# Altium schematic sheet PWR.SchDoc: PWR
size 420 x 297 mm; Organization: Altium Limited; Address1: L3, 12a Rodborough Rd; Address2: Frenchs Forest; Address3: NSW; Address4: Australia 2086; SheetNumber: 3; SheetTotal: 8
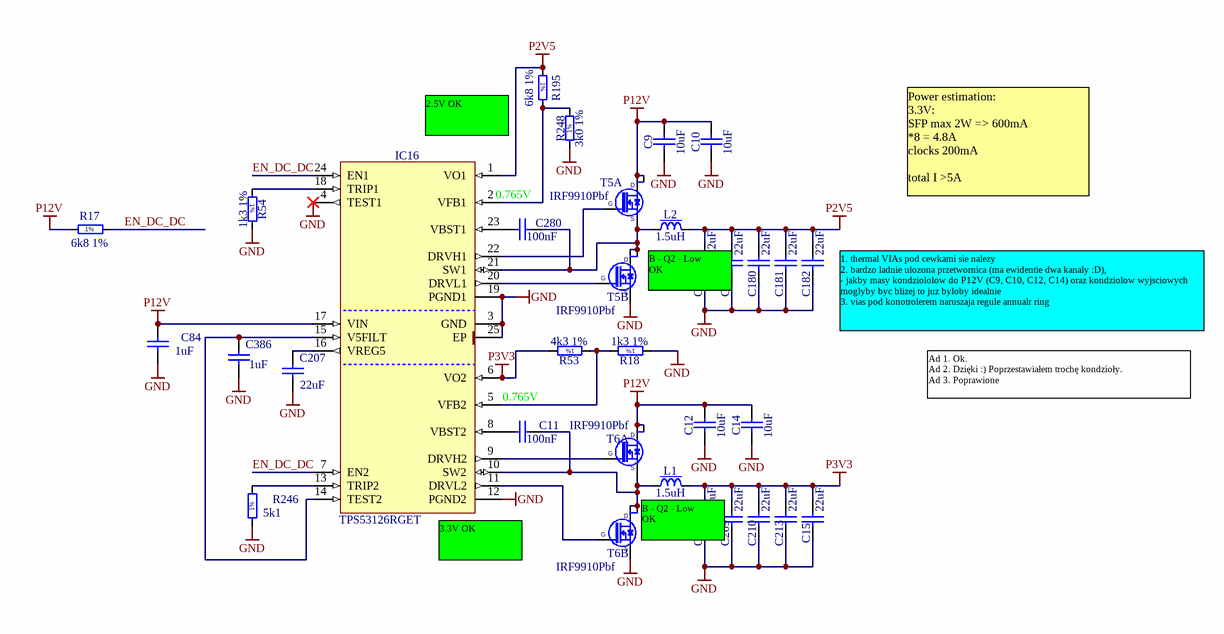
[diagram p0: PWR.SchDoc]

## Parts
C9  10uF  [CAPC3216X140N]
C10  10uF  [CAPC3216X140N]
C11  100nF  [CAPC1608X87N]
C12  10uF  [CAPC3216X140N]
C14  10uF  [CAPC3216X140N]
C15  22uF  [CAPC3216X180N]
C84  1uF  [CAPC1608X87N]
C176  22uF  [CAPC3216X180N]
C179  22uF  [CAPC3216X180N]
C180  22uF  [CAPC3216X180N]
C181  22uF  [CAPC3216X180N]
C182  22uF  [CAPC3216X180N]
C207  22uF  [CAPC3216X180N]
C208  22uF  [CAPC3216X180N]
C209  22uF  [CAPC3216X180N]
C210  22uF  [CAPC3216X180N]
C213  22uF  [CAPC3216X180N]
C280  100nF  [CAPC1608X87N]
C386  1uF  [CAPC1608X87N]
IC16  TPS53126RGET  [QFN50P400X400X100-25N-S255]
L1  1.5uH  [INDM6965X300N]
L2  1.5uH  [INDM6965X300N]
R17  6k8 1%  [0603R]
R18  1k3 1%  [0603R]
R53  4k3 1%  [0603R]
R54  1k3 1%  [0603R]
R195  6k8 1%  [0603R]
R246  5k1  [RESC1608X55N]
R248  3k0 1%  [0603R]
T5  IRF9910Pbf  [SOIC127P600X175-8N]  (parts A,B of 2)
T6  IRF9910Pbf  [SOIC127P600X175-8N]  (parts A,B of 2)

## Nets
GND: C9.1 C10.1 C12.1 C14.1 C15.1 C84.2 C176.1 C179.1 C180.1 C181.1 C182.1 C207.1 C208.1 C209.1 C210.1 C213.1 C386.1 IC16.3(GND) IC16.4(TEST1) IC16.12(PGND2) IC16.19(PGND1) IC16.25(EP) R18.1 R54.2 R246.1 R248.1 T5.1(S) T6.1(S)
P2V5: C176.2 C179.2 C180.2 C181.2 C182.2 IC16.1(VO1) L2.2 R195.1
P3V3: C15.2 C208.2 C209.2 C210.2 C213.2 IC16.6(VO2) L1.2 R53.2
P12V: C9.2 C10.2 C12.2 C14.2 C84.1 IC16.17(VIN) R17.1 T5.5(D) T5.6(D) T6.5(D) T6.6(D)
EN_DC_DC: IC16.7(EN2) IC16.24(EN1) R17.2
NetC11_1: C11.1 IC16.10(SW2) L1.1 T6.3(S) T6.7(D) T6.8(D)
NetC11_2: C11.2 IC16.8(VBST2)
NetC207_2: C207.2 IC16.16(VREG5)
NetC280_1: C280.1 IC16.21(SW1) L2.1 T5.3(S) T5.7(D) T5.8(D)
NetC280_2: C280.2 IC16.23(VBST1)
NetC386_2: C386.2 IC16.14(TEST2) IC16.15(V5FILT)
NetIC16_2: IC16.2(VFB1) R195.2 R248.2
NetIC16_5: IC16.5(VFB2) R18.2 R53.1
NetIC16_9: IC16.9(DRVH2) T6.4(G)
NetIC16_11: IC16.11(DRVL2) T6.2(G)
NetIC16_13: IC16.13(TRIP2) R246.2
NetIC16_18: IC16.18(TRIP1) R54.1
NetIC16_20: IC16.20(DRVL1) T5.2(G)
NetIC16_22: IC16.22(DRVH1) T5.4(G)

## Notes on the sheet
- 2.5V OK
- 0.765V
- Power estimation:
  3.3V:
  SFP max 2W => 600mA
  *8 = 4.8A
  clocks 200mA
  total I >5A
- B - Q2 - Low
  OK
- (near C182) 1. thermal VIAs pod cewkami sie nalezy
  2. bardzo ladnie ulozona przetwornica (ma ewidentie dwa kanaly :D),
  - jakby masy kondziololow do P12V (C9, C10, C12, C14) oraz kondziolow wyjsciowych moglyby byc blizej to juz byloby idealnie
  3. vias pod konotrolerem naruszaja regule annualr ring
- Ad 1. Ok.
  Ad 2. Dzięki :) Poprzestawiałem trochę kondzioły.
  Ad 3. Poprawione
- (near IC16) 3.3V OK
- Project/Equipment
- Document
- uTCA RTM 8 SFP+
- Designer
- Drawn by
- Check.by
- Copyright Creotech Instruments SA 2014.
  This documentation describes Open Hardware and is licensed under the CERN OHL v.1.1. You may redistribute and modify this documentation under the terms of the CERN OHL v.1.1. (http://ohwr.org/CERNOHL). This documentation is distributed WITHOUT ANY EXPRESS OR IMPLIED WARRANTY, INCLUDING OF MERCHANTABILITY, SATISFACTORY QUALITY AND FITNESS FOR A PARTICULAR PURPOSE. Please see the CERN OHL v.1.1 for applicable conditions.
- Creotech Instruments S.A.
- File
- Last Mod.
- Print Date
- Sheet
- Size
- A3
- of
- Rev
- (in symbol R0603_1K3_1%_0.1W_100PPM) 1%
- (in symbol R0603_3K_1%_0.1W_100PPM) 1%
- (in symbol R0603_4K3_1%_0.1W_100PPM) 1%
- (in symbol R0603_5K1_1%_0.1W_100PPM) 1%
- (in symbol R0603_6K8_1%_0.1W_100PPM) 1%

## Library data of the parts
C9 C10 C12 C14 = CC1206_10UF_16V_10%_X7R: Non-polarised capacitor; Part Description: SMD Multilayer Chip Ceramic Capacitor; Manufacturer: GENERIC; Manufacturer1 Part Number: C1206C106K4RAC; Voltage: 16V; TC: X7R; Tolerance: ±10%; Table: Capacitors SMD; Part Number: CC1206_10UF_16V_10%_X7R; Component Kind: Standard; Component Type: Standard; Pin Count: 2; Value: 10uF; Status: Preferred; Manufacturer Part Number: CC1206_10uF_16V_10%_X7R; Case: 1206; Mounted: Yes; Socket: No; SMD: Yes; Manufacturer1 Example: KEMET; Manufacturer1 ComponentHeight: 1.8mm; HelpURL: \\cern.ch\dfs\Applications\Altium\Datasheets\CC1206_X7R_KEMET.pdf; Author: CERN DEM JLC; CreateDate: 2009-04-28; LatestRevisionDate: 2009-04-28
C11 C280 = CC0603_100NF_50V_10%_X7R: Non-polarised capacitor; Part Description: SMD Multilayer Chip Ceramic Capacitor; Manufacturer: GENERIC; Manufacturer1 Part Number: 223858615649; Voltage: 50V; TC: X7R; Tolerance: ±10%; Table: Capacitors SMD; Part Number: CC0603_100NF_50V_10%_X7R; Component Kind: Standard; Component Type: Standard; Pin Count: 2; Value: 100nF; Status: Preferred; Manufacturer Part Number: CC0603_100NF_50V_10%_X7R; Case: 0603; Mounted: Yes; Socket: No; SMD: Yes; Manufacturer1 Example: PHYCOMP; Manufacturer1 ComponentHeight: 0.87mm; HelpURL: \\cern.ch\dfs\Applications\Altium\Datasheets\CC0603_X7R_PHYCOMP.pdf; Author: CERN DEM JLC; CreateDate: 2007-12-03; LatestRevisionDate: 2007-12-03
C15 C176 C179-C182 C207-C210 C213 = CC1206_22UF_10V_10%_X7R: Non-polarised capacitor; Part Description: SMD Multilayer Chip Ceramic Capacitor; Manufacturer: GENERIC; Manufacturer1 Part Number: GRM31CR71A226KE15L; Voltage: 10V; TC: X7R; Tolerance: ±10%; Table: Capacitors SMD; Part Number: CC1206_22UF_10V_10%_X7R; Component Kind: Standard; Component Type: Standard; Pin Count: 2; Value: 22uF; Status: Preferred; Manufacturer Part Number: CC1206_22UF_10V_10%_X7R; Case: 1206; Mounted: Yes; Socket: No; SMD: Yes; Manufacturer1 Example: MURATA; Manufacturer1 ComponentHeight: 1.8mm; HelpURL: \\cern.ch\dfs\Applications\Altium\Datasheets\CC1206_X7R_MURATA_GRM-HI-CAP.pdf; Author: CERN DEM JLC; CreateDate: 2010-06-08; LatestRevisionDate: 2010-06-08
C84 C386 = CC0603_1UF_16V_10%_X7R: Non-polarised capacitor; Part Description: SMD Multilayer Chip Ceramic Capacitor; Manufacturer: GENERIC; Manufacturer1 Part Number: 223824613663; Voltage: 16V; TC: X7R; Tolerance: ±10%; Table: Capacitors SMD; Part Number: CC0603_1UF_16V_10%_X7R; Component Kind: Standard; Component Type: Standard; Pin Count: 2; Value: 1uF; Status: Preferred; Manufacturer Part Number: CC0603_1uF_16V_10%_X7R; Case: 0603; Mounted: Yes; Socket: No; SMD: Yes; Manufacturer1 Example: PHYCOMP; Manufacturer1 ComponentHeight: 0.87mm; HelpURL: \\cern.ch\dfs\Applications\Altium\Datasheets\CC0805_X5R_PHYCOMP_HC.pdf; Author: CERN DEM JLC
  C84: CreateDate: 12/3/2007; LatestRevisionDate: 12/3/2007
  C386: CreateDate: 03/12/2007; LatestRevisionDate: 03/12/2007
IC16 = TPS53126RGET: Dual Synchronous Step-Down Controller For Low Voltage Power Rails; Manufacturer: TEXAS INSTRUMENTS; Table: Analog & Interface; Part Number: TPS53126RGET; Component Kind: Standard; Component Type: Standard; Device: TPS53126RGET; PackageDescription: QFN,0.50mm pitch,square;6 pin X 6 pin,4.15mm X 4.15mm X 1.00mm H body (w/thermal tab 2.55 X 2.55mm),  IPC Medium Density; Part Description: Dual Synchronous Step-Down Controller For Low Voltage Power Rails; Manufacturer Part Number: TPS53126RGET; Pin Count: 25; Case: QFN24; Mounted: Yes; Socket: No; SMD: Yes; ComponentHeight: 1.0mm; Author: CERN DEM JLC; HelpURL: \\cern.ch\dfs\Applications\Altium\Datasheets\TPS53126RGET.pdf; CreateDate: 2010-08-26; LatestRevisionDate: 2010-08-26
L1 L2 = IND2525_1.5UH_20%_VISHAY_IHLP-2525CZ: Inductor With Magnetic core; Part Description: Low Profile, High Current IHLP® Inductor; Manufacturer: VISHAY DALE; Manufacturer Part Number: IHLP2525CZER1R5M01; Power: 9A; Resistance: 0.014R; Tolerance: ±20%; Table: Inductors SMD; Part Number: IND2525_1.5UH_20%_VISHAY_IHLP-2525CZ; Component Kind: Standard; Component Type: Standard; Pin Count: 2; Value: 1.5uH; Status: None; Case: 2525; Mounted: Yes; Socket: No; SMD: Yes; ComponentHeight: 3mm; HelpURL: \\cern.ch\dfs\Applications\Altium\Datasheets\IND2525_VISHAY_IHLP-2525CZ.pdf; Author: CERN DEM JLC; CreateDate: 2012-10-24; LatestRevisionDate: 2012-10-24
R17 R195 = R0603_6K8_1%_0.1W_100PPM: Resistor - 1%; Part Description: General Purpose Thick Film Chip Resistor; Manufacturer: GENERIC; Manufacturer1 Part Number: NRC06F6801TRF; Power: 0.1W; TC: ±100ppm/°C; Table: Resistors SMD; Part Number: R0603_6K8_1%_0.1W_100PPM; Component Kind: Standard; Component Type: Standard; Footprint: RESC1608X55N; Pin Count: 2; Value: 6k8; Status: Preferred; Tolerance: ±1%; Manufacturer Part Number: R0603_6K8_1%_0.1W_100PPM; Case: 0603; Mounted: Yes; Socket: No; SMD: Yes; Manufacturer1 Example: NIC COMPONENT; Manufacturer1 ComponentHeight: 0.55mm; HelpURL: \\cern.ch\dfs\Applications\Altium\Datasheets\R0603_NIC_NRC.pdf; Author: CERN DEM JLC; CreateDate: 2007-12-03; LatestRevisionDate: 2008-03-13
R18 R54 = R0603_1K3_1%_0.1W_100PPM: Resistor - 1%; Part Description: General Purpose Thick Film Chip Resistor; Manufacturer: GENERIC; Manufacturer1 Part Number: NRC06F1301TRF; Power: 0.1W; TC: ±100ppm/°C; Table: Resistors SMD; Part Number: R0603_1K3_1%_0.1W_100PPM; Component Kind: Standard; Component Type: Standard; Footprint: RESC1608X55N; Pin Count: 2; Value: 1k3; Status: Preferred; Tolerance: ±1%; Manufacturer Part Number: R0603_1K3_1%_0.1W_100PPM; Case: 0603; Mounted: Yes; Socket: No; SMD: Yes; Manufacturer1 Example: NIC COMPONENT; Manufacturer1 ComponentHeight: 0.55mm; HelpURL: \\cern.ch\dfs\Applications\Altium\Datasheets\R0603_NIC_NRC.pdf; Author: CERN DEM JLC; CreateDate: 2007-12-03; LatestRevisionDate: 2008-03-13
R53 = R0603_4K3_1%_0.1W_100PPM: Resistor - 1%; Part Description: General Purpose Thick Film Chip Resistor; Manufacturer: GENERIC; Manufacturer1 Part Number: NRC06F4301TRF; Power: 0.1W; TC: ±100ppm/°C; Table: Resistors SMD; Part Number: R0603_4K3_1%_0.1W_100PPM; Component Kind: Standard; Component Type: Standard; Footprint: RESC1608X55N; Pin Count: 2; Value: 4k3; Status: Preferred; Tolerance: ±1%; Manufacturer Part Number: R0603_4K3_1%_0.1W_100PPM; Case: 0603; Mounted: Yes; Socket: No; SMD: Yes; Manufacturer1 Example: NIC COMPONENT; Manufacturer1 ComponentHeight: 0.55mm; HelpURL: \\cern.ch\dfs\Applications\Altium\Datasheets\R0603_NIC_NRC.pdf; Author: CERN DEM JLC; CreateDate: 2007-12-03; LatestRevisionDate: 2008-03-13
R246 = R0603_5K1_1%_0.1W_100PPM: Resistor - 1%; Part Description: General Purpose Thick Film Chip Resistor; Manufacturer: GENERIC; Manufacturer1 Part Number: NRC06F5101TRF; Power: 0.1W; TC: ±100ppm/°C; Table: Resistors SMD; Part Number: R0603_5K1_1%_0.1W_100PPM; Component Kind: Standard; Component Type: Standard; Pin Count: 2; Value: 5k1; Status: Preferred; Tolerance: ±1%; Manufacturer Part Number: R0603_5K1_1%_0.1W_100PPM; Case: 0603; Mounted: Yes; Socket: No; SMD: Yes; Manufacturer1 Example: NIC COMPONENT; Manufacturer1 ComponentHeight: 0.55mm; HelpURL: \\cern.ch\dfs\Applications\Altium\Datasheets\R0603_NIC_NRC.pdf; Author: CERN DEM JLC; CreateDate: 2007-12-03; LatestRevisionDate: 2008-03-13
R248 = R0603_3K_1%_0.1W_100PPM: Resistor - 1%; Part Description: General Purpose Thick Film Chip Resistor; Manufacturer: GENERIC; Manufacturer1 Part Number: NRC06F3001TRF; Value: 3k; Power: 0.1W; TC: ±100ppm/°C; Table: Resistors SMD; Part Number: R0603_3K_1%_0.1W_100PPM; Component Kind: Standard; Component Type: Standard; Footprint: RESC1608X55N; Pin Count: 2; Status: Preferred; Tolerance: ±1%; Manufacturer Part Number: R0603_3K_1%_0.1W_100PPM; Case: 0603; Mounted: Yes; Socket: No; SMD: Yes; Manufacturer1 Example: NIC COMPONENT; Manufacturer1 ComponentHeight: 0.55mm; HelpURL: \\cern.ch\dfs\Applications\Altium\Datasheets\R0603_NIC_NRC.pdf; Author: CERN DEM JLC; CreateDate: 2007-12-03; LatestRevisionDate: 2008-03-13
T5 T6 = IRF9910Pbf: Dual SO-8 MOSFET For POL Cconverter; Part Description: 20V 10A(Q1) 20V 12A (Q2) Dual SO-8 MOSFET For POL Cconverter; Manufacturer: INTERNATIONAL RECTIFIER; Table: Transistors; Part Number: IRF9910Pbf; Component Kind: Standard; Component Type: Standard; Device: IRF9910Pbf; PackageDescription: SOIC 8, Pitch 1.27mm - Body 4x5mm, IPC Medium Density; Manufacturer Part Number: IRF9910Pbf; Pin Count: 8; Case: DO8; Mounted: Yes; Socket: No; SMD: Yes; ComponentHeight: 1.75mm; HelpURL: \\cern.ch\dfs\Applications\Altium\Datasheets\IRF9910Pbf.pdf; Author: CERN DEM JLC; CreateDate: 2010-08-30; LatestRevisionDate: 2010-08-30